# EAGLE design tiny_breadboard (EAGLE 9.6.2)
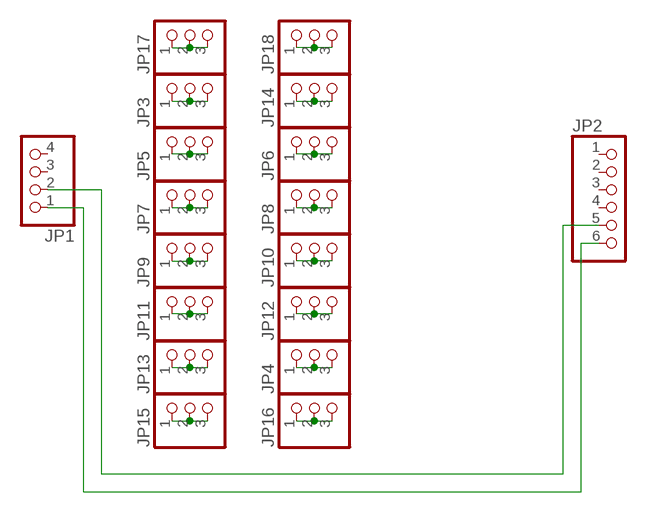
[diagram p0: schematic, sheet 1]

## Parts
JP1  PINHD-1X4  [1X04]
JP2  PINHD-1X6  [1X06]
JP3  PINHD-1X3  [1X03]
JP4  PINHD-1X3  [1X03]
JP5  PINHD-1X3  [1X03]
JP6  PINHD-1X3  [1X03]
JP7  PINHD-1X3  [1X03]
JP8  PINHD-1X3  [1X03]
JP9  PINHD-1X3  [1X03]
JP10  PINHD-1X3  [1X03]
JP11  PINHD-1X3  [1X03]
JP12  PINHD-1X3  [1X03]
JP13  PINHD-1X3  [1X03]
JP14  PINHD-1X3  [1X03]
JP15  PINHD-1X3  [1X03]
JP16  PINHD-1X3  [1X03]
JP17  PINHD-1X3  [1X03]
JP18  PINHD-1X3  [1X03]

## Nets
GND: JP1.2 JP2.5
N$1: JP17.1 JP17.2 JP17.3
N$2: JP15.1 JP15.2 JP15.3
N$3: JP13.1 JP13.2 JP13.3
N$4: JP11.1 JP11.2 JP11.3
N$5: JP9.1 JP9.2 JP9.3
N$6: JP7.1 JP7.2 JP7.3
N$7: JP5.1 JP5.2 JP5.3
N$8: JP3.1 JP3.2 JP3.3
N$9: JP4.1 JP4.2 JP4.3
N$10: JP6.1 JP6.2 JP6.3
N$11: JP8.1 JP8.2 JP8.3
N$12: JP10.1 JP10.2 JP10.3
N$13: JP12.1 JP12.2 JP12.3
N$14: JP14.1 JP14.2 JP14.3
N$15: JP16.1 JP16.2 JP16.3
N$16: JP18.1 JP18.2 JP18.3
VDD: JP1.1 JP2.6
Unconnected: JP1.3 JP1.4 JP2.1 JP2.2 JP2.3 JP2.4

## Library data of the parts
JP1 = pinhead2:PINHD-1X4: PIN HEADER
JP2 = pinhead2:PINHD-1X6: PIN HEADER
JP3-JP18 = pinhead2:PINHD-1X3: PIN HEADER

## Board
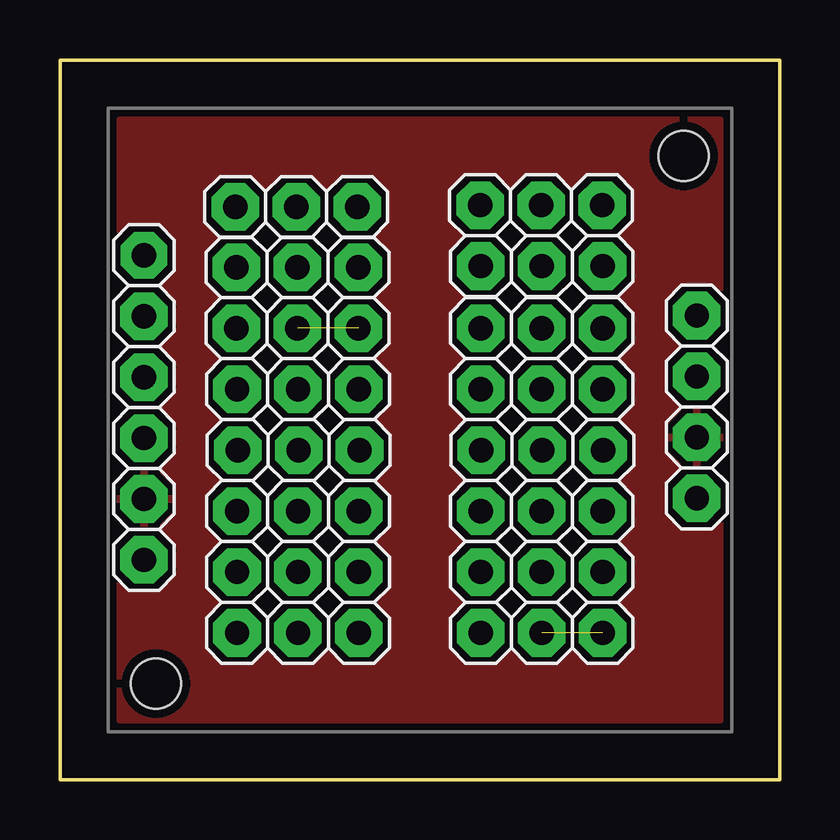
[diagram p1: board, top side]
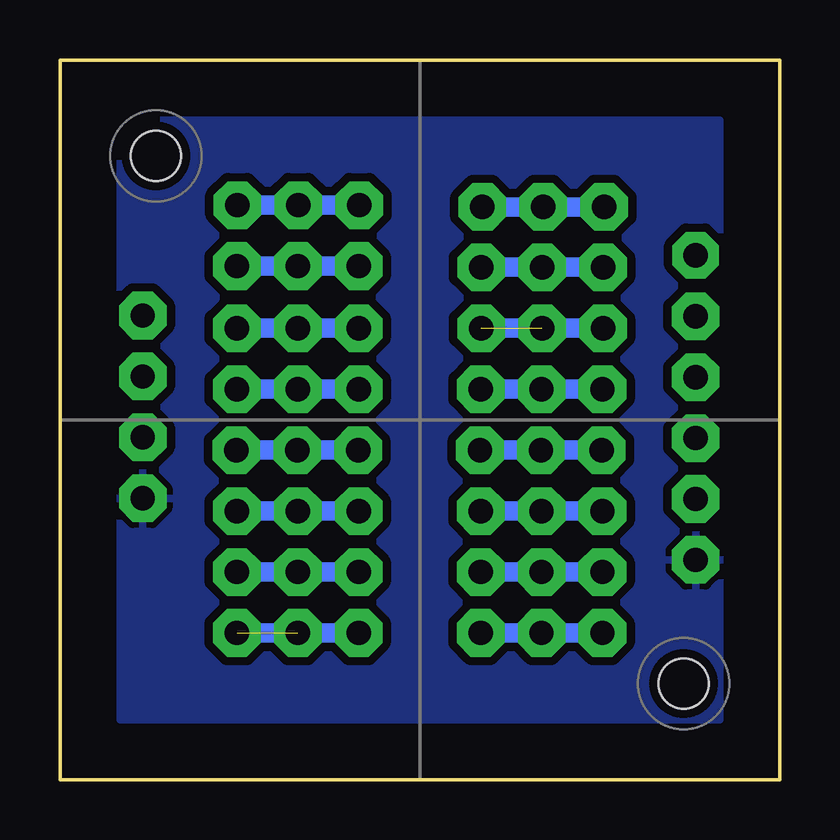
[diagram p2: board, bottom side, seen from below]

Size 30 x 30 mm. Coordinates in mm from the lower left corner, seen from the top.
Outline: 0,0 30,0 30,30 0,30 0,0
Copper layers (1*16): Top 0.035mm / dielectric 1.5mm / Bottom 0.035mm
Design rules "default *": minimum track width 14mil, minimum drill 0.35mm, track to track 14mil, track to pad 13mil, pad to pad 14mil, via to via 14mil, smd to smd 14mil, copper to edge 15mil, drill to drill 15mil, minimum pad ring 10mil, minimum via ring 8mil, stop-mask expansion 4mil, vias tented up to drill 0mil, thermal gap 10mil
Holes 2.1 mm at 26,26 4,4

### Footprints (pad centres in the part's own frame; a part is rotated, then mirrored left to right if it is on the bottom)
1X04 = drill 1.016 pad 1.981 octagon: 1 -3.81,0; 2 -1.27,0; 3 1.27,0; 4 3.81,0
1X06 = drill 1.016 pad 1.93 octagon: 1 -6.35,0 | drill 1.016 pad 1.981 octagon: 2 -3.81,0; 3 -1.27,0; 4 1.27,0; 5 3.81,0; 6 6.35,0
1X03 = drill 1.016 pad 1.981 octagon: 1 -2.54,0; 2 0,0; 3 2.54,0

### Placement (x,y rotation side)
JP1  26.55,15.53 90 top
JP2  3.5,15.51 270 top
JP3  9.85,23.87 0 top
JP4  20.08,18.81 0 top
JP5  9.92,16.27 0 top
JP6  20.08,16.27 0 top
JP7  9.95,13.73 0 top
JP8  20.11,13.73 0 top
JP9  9.92,11.19 0 top
JP10  20.08,11.19 0 top
JP11  9.92,8.65 0 top
JP12  20.08,8.65 0 top
JP13  9.92,6.11 0 top
JP14  20.06,23.95 0 top
JP15  20.08,6.11 0 top
JP16  9.9,18.81 0 top
JP17  9.9,21.35 0 top
JP18  20.08,21.41 0 top

### Tracks (layer width: path | path; a pad name or v marks a point on that pad's centre or on a via)
GND
  pour Top: 2.5,27.5 27.5,27.5 27.5,2.5 2.5,2.5
N$1
  Bottom 0.813: JP17.1 JP17.2 JP17.3
N$2  (1 unrouted)
  Bottom 0.813: JP15.1 JP15.3
N$3
  Bottom 0.813: JP13.1 JP13.2 JP13.3
N$4
  Bottom 0.813: JP11.3 JP11.2 JP11.1
N$5
  Bottom 0.813: JP9.1 JP9.2 JP9.3
N$6
  Bottom 0.813: JP7.3 JP7.2 JP7.1
N$7
  Bottom 0.813: JP5.1 JP5.2 JP5.3
N$8
  Bottom 0.813: JP3.3 JP3.2 JP3.1
N$9
  Bottom 0.813: JP4.3 JP4.2 JP4.1
N$10
  Bottom 0.813: JP6.3 JP6.2 JP6.1
N$11
  Bottom 0.813: JP8.1 JP8.2 JP8.3
N$12
  Bottom 0.813: JP10.3 JP10.2 JP10.1
N$13
  Bottom 0.813: JP12.1 JP12.2 JP12.3
N$14
  Bottom 0.813: JP14.3 JP14.2 JP14.1
N$15  (1 unrouted)
  Bottom 0.813: JP16.1 JP16.3
N$16
  Bottom 0.813: JP18.1 JP18.2 JP18.3
VDD
  pour Bottom: 2.5,27.5 27.5,27.5 27.5,2.5 2.5,2.5

### Text on the board
bDocu: A